# EAGLE design highAmpLedStrip (EAGLE 8.4.3)
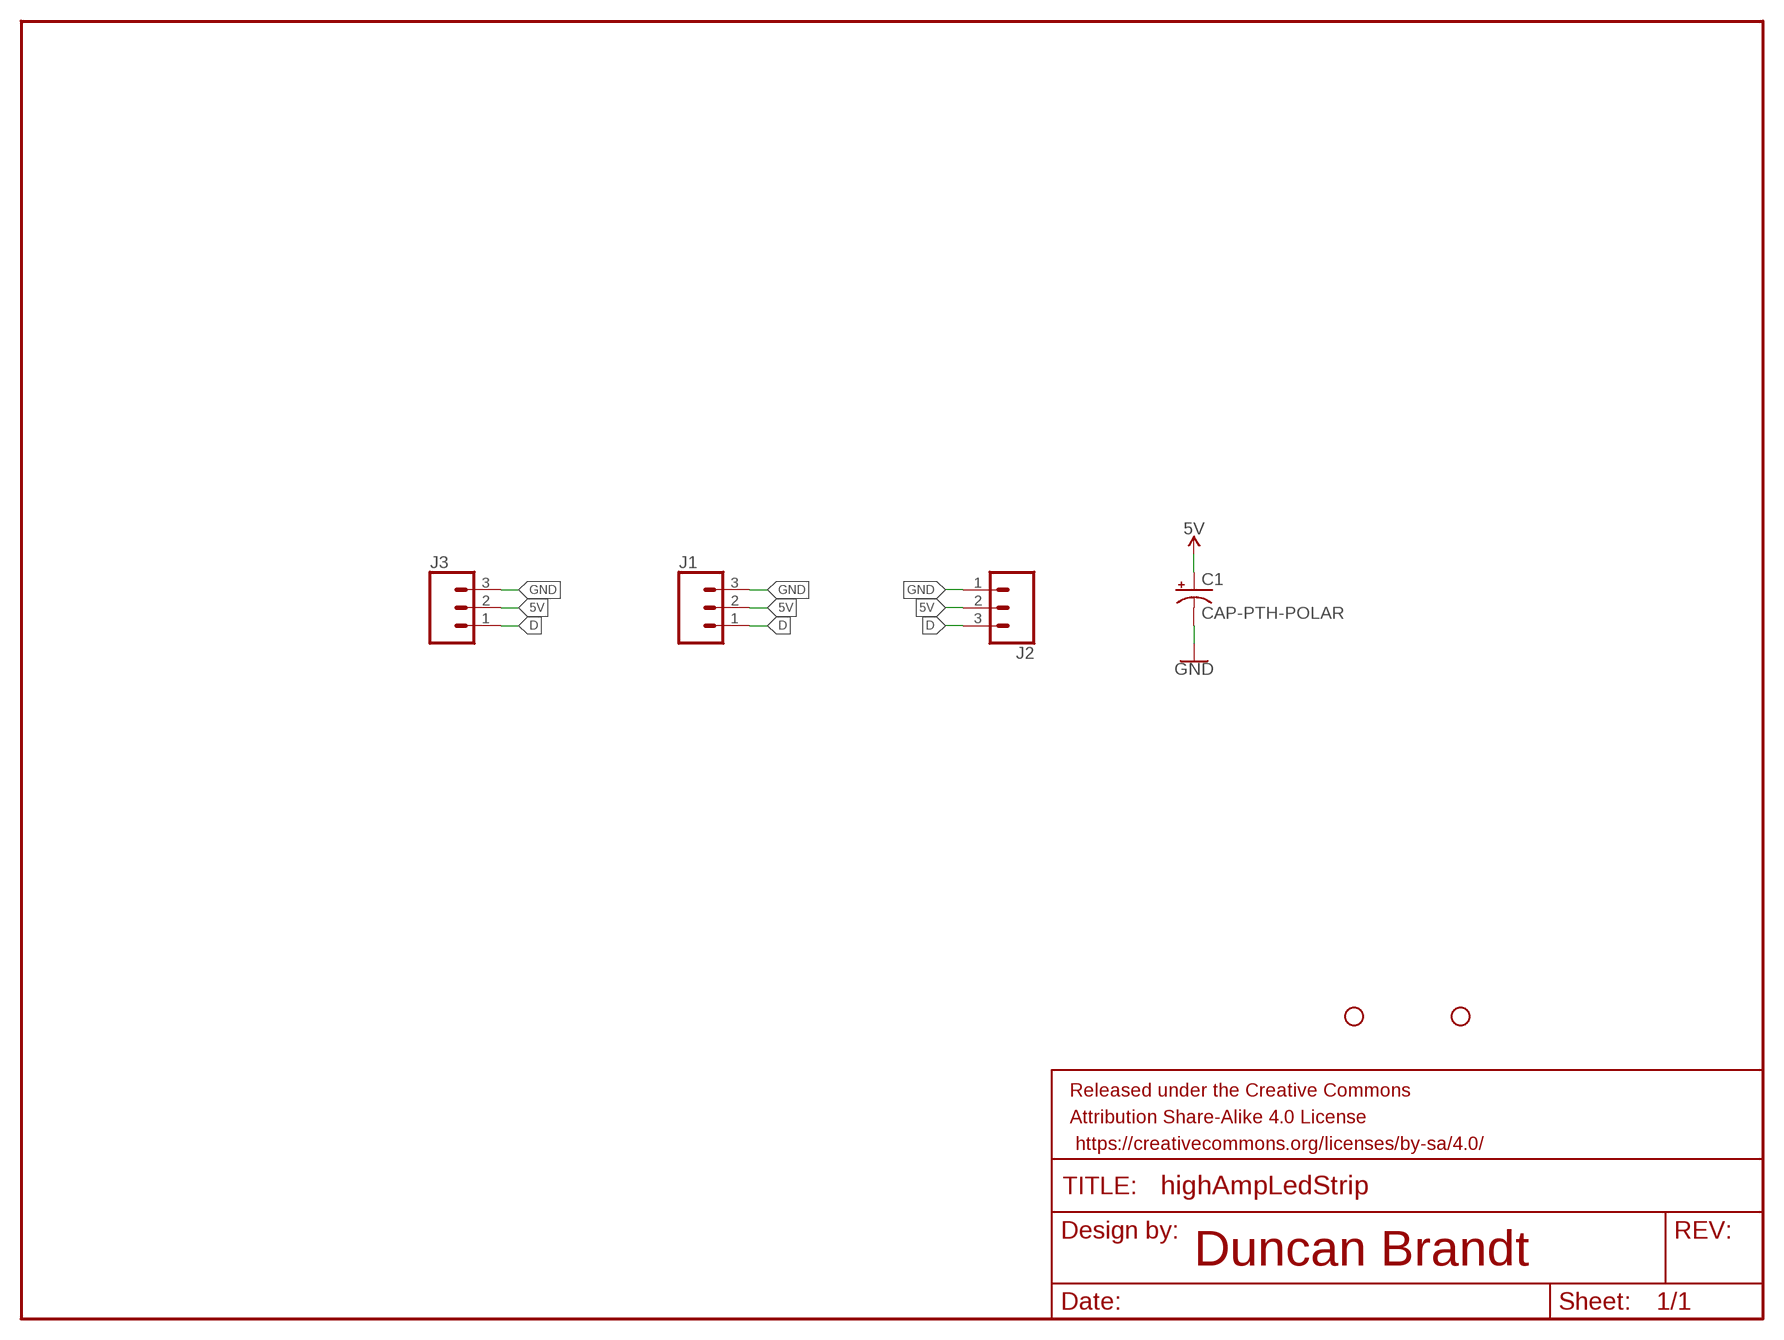
[diagram p0: schematic, sheet 1]

## Parts
C1  CAP-PTH-POLAR  [CPOL-RADIAL-2.5MM-5MM]
FRAME1  FRAME-LETTER  [CREATIVE_COMMONS]
H1  STAND-OFF  [STAND-OFF]
H2  STAND-OFF  [STAND-OFF]
J1  CONN_03LONGPADS  [1X03_LEDSTRIP_LONGPADS]
J2  CONN_031X03_NO_SILK  [1X03_5MM_SCREWTERM]
J3  CONN_03  [1X03]

## Nets
5V: C1.1(+) J1.2 J2.2 J3.2
D: J1.1 J2.3 J3.1
GND: C1.2(-) J1.3 J2.1 J3.3

## Notes on the sheet
- Duncan Brandt

## Library data of the parts
C1 = DB-CAP:CAP-PTH-POLAR: Small PTH Polarized Capacitors A capacitor is a passive two-terminal electrical component used to store electrical energy temporarily in an electric field. DB BOARDS: DB Drawing Board <www.dbboards.com>
FRAME1 = DB-SYMBOLS:FRAME-LETTER: Schematic Frame - Letter Standard 8.5x11 US Letter frame
H1 H2 = DB-HARDWARE:STAND-OFF: #4 Phillips Hole Screw Hole Mount Hole DB BOARDS: DB Drawing Board <www.dbboards.com>
J1-J3 = DB-CONN:CONN_03: 3 Pin Headers Single connection point. Often used as Generic Header-pin footprint for 0.1 inch spaced/style header connections DB BOARDS: DB LED Strip Boards <www.dbboards.com>

## Board
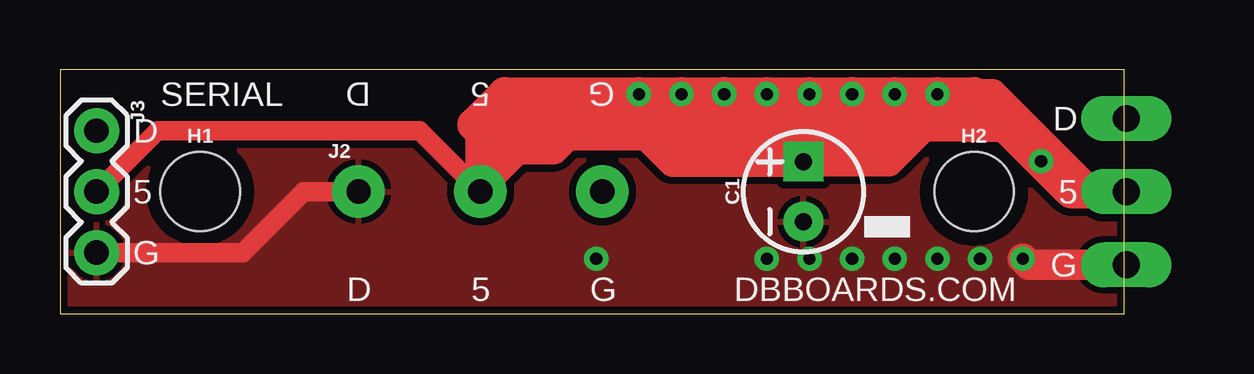
[diagram p1: board, top side]
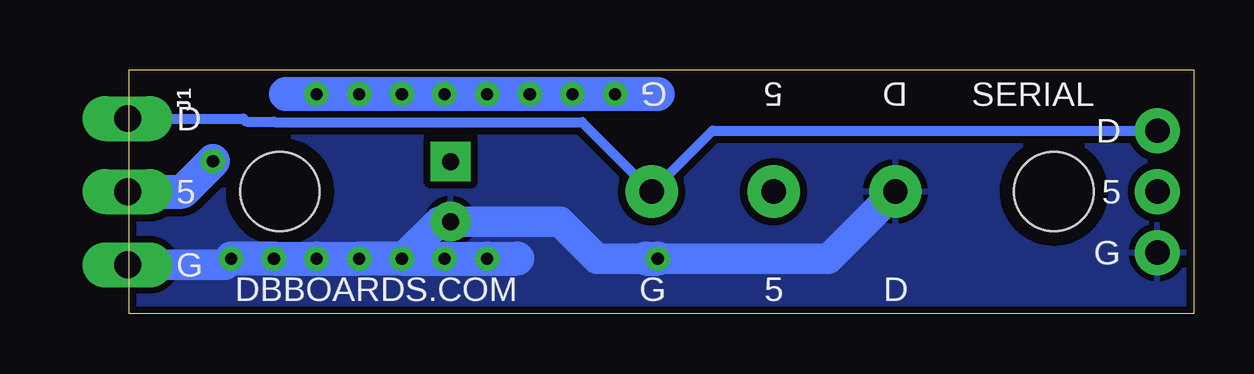
[diagram p2: board, bottom side, seen from below]

Size 44.37 x 10.15 mm. Coordinates in mm from the lower left corner, seen from the top.
Outline: 0,0 44.37,0 44.37,10.15 0,10.15 0,0
Copper layers (1*16): Top 0.035mm / dielectric 1.5mm / Bottom 0.035mm
Design rules "SparkFun-2-layer-STANDARD": minimum track width 10mil, minimum drill 20mil, track to track 10mil, track to pad 8mil, pad to pad 8mil, via to via 10mil, smd to smd 8mil, copper to edge 8mil, drill to drill 8mil, minimum pad ring 10mil, minimum via ring 10mil, stop-mask expansion 4mil, vias tented up to drill 25mil, thermal gap 10mil

### Footprints (pad centres in the part's own frame; a part is rotated, then mirrored left to right if it is on the bottom)
CPOL-RADIAL-2.5MM-5MM = drill 0.7 pad 1.651 square: 1 1.25,0 | drill 0.7 pad 1.651: 2 -1.25,0
STAND-OFF = hole 3.302: 0,0
1X03_LEDSTRIP_LONGPADS = drill 1.118 pad 1.88 long: 1 0,0; 2 3.048,0; 3 6.096,0
1X03_5MM_SCREWTERM = drill 1.016 pad 2.184: 1 0,0; 2 5.08,0; 3 10.16,0
1X03 = drill 1.016 pad 1.88: 1 0,0; 2 2.54,0; 3 5.08,0

### Placement (x,y rotation side)
C1  30.99,5.08 90 top
FRAME1  -101.6,1.27 0 top  (outside the outline)
H1  5.84,5.08 0 top
H2  38.1,5.08 0 top
J1  44.45,8.13 270 bottom
J2  12.45,5.08 0 top
J3  1.52,7.62 270 top

### Tracks (layer width: path | path; a pad name or v marks a point on that pad's centre or on a via)
5V  (via drill 0.51)
  Top 0.813: J3.2 4.06,7.62 14.99,7.62 J2.2
  Top 1.27: 37.59,7.87 36.07,7.87 34.54,6.35 31.01,6.35 C1.1 25.55,6.33 24.38,7.49 | 35.31,7.87 34.92,7.49 27.18,7.49 | 38.1,9.14 38.86,9.14 42.93,5.08 | J2.2 17.53,8.13 18.54,9.14 | J2.2 17.53,6.6 18.8,7.87 | J2.2 17.53,5.33 19.05,6.86 20.57,6.86 21.59,7.87
  Top 1.422: J1.2 42.93,5.08 42.16,5.08 v40.89,6.35 39.37,7.87 | 39.37,7.87 37.59,7.87 35.31,7.87 28.21,7.87 | 20.83,7.87 21.21,7.49 24.38,7.49 27.18,7.49 27.83,7.49 28.21,7.87 | 20.83,7.87 18.8,7.87 17.27,7.87 18.54,9.14 v24.13,9.14 v25.91,9.14 v27.69,9.14 v29.46,9.14 v31.24,9.14 v33.02,9.14 v34.8,9.14 v36.58,9.14 38.1,9.14 39.37,7.87 | 20.83,7.87 21.59,7.87 28.21,7.87
  Bottom 1.422: J1.2 42.16,5.08 v40.89,6.35 | 22.35,9.14 v24.13,9.14 v25.91,9.14 v27.69,9.14 v29.46,9.14 v31.24,9.14 v33.02,9.14 v34.8,9.14 v36.58,9.14 37.85,9.14
D
  Bottom 0.406: J3.1 20.07,7.62 J2.3 25.5,7.98 38.33,7.98 38.35,8 39.5,8 39.62,8.13 J1.1
GND  (via drill 0.51)
  Top 0.813: J2.1 10.16,5.08 7.62,2.54 J3.3
  Top 1.27: v40.13,2.29 40.39,2.03 43.54,2.03
  Bottom 1.27: 22.86,2.29 24.89,2.29 26.44,3.83 C1.2 31.48,3.83 v33.02,2.29 | v22.35,2.29 15.24,2.29 J2.1 | v40.13,2.29 40.39,2.03 43.54,2.03
  Bottom 1.422: v40.13,2.29 v38.35,2.29 v36.58,2.29 v34.8,2.29 v33.02,2.29 v31.24,2.29 v29.46,2.29 28.21,2.29 | 22.86,2.29 v22.35,2.29
  pour Bottom (isolate 0.305): 0,10.16 44.45,10.16 44.45,0 0,0
  pour Top (isolate 0.305): 0,10.16 44.45,10.16 44.45,0 0,0

### Text on the board
tPlace: D | 5 | G | SERIAL | D | D | 5 | 5 | G | G | DBBOARDS.COM | D | 5 | G
bPlace: D | 5 | G | SERIAL | D | D | 5 | 5 | G | DBBOARDS.COM | G | D | 5 | G